# Altium schematic sheet Sheet3.SchDoc
size B; Author: E. Sims; Organization: Let's Build Rockets Inc.; SheetNumber: 4; SheetTotal: 4
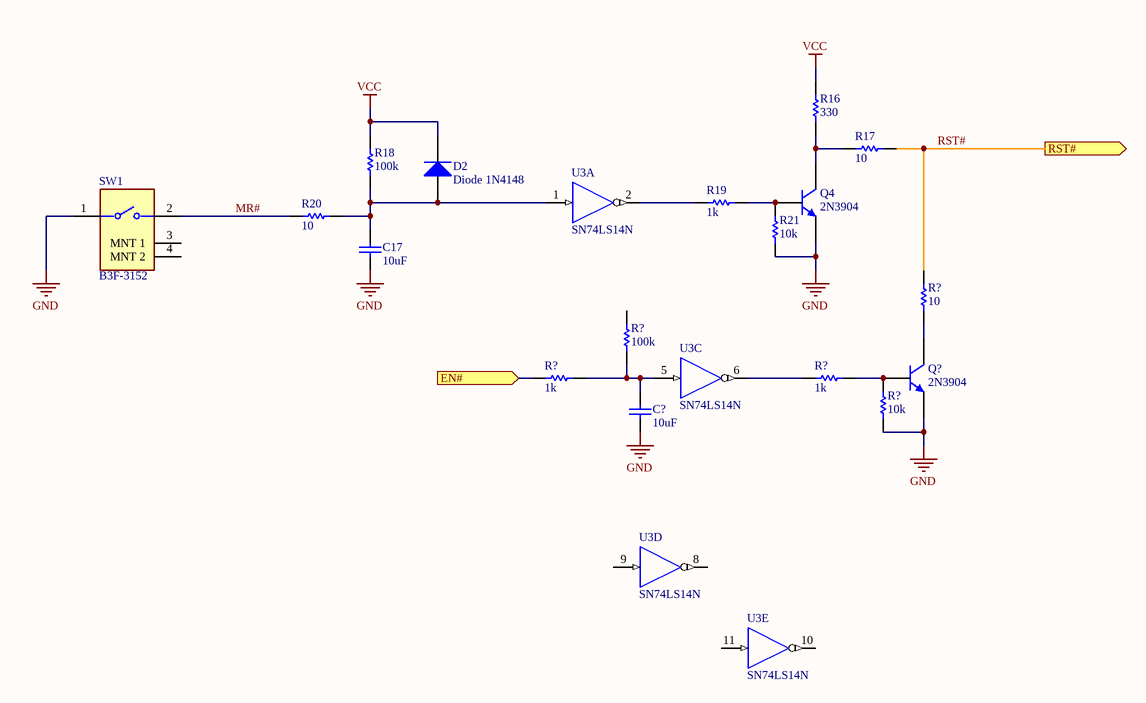
[diagram p0: Sheet3.SchDoc]

## Parts
(Parts that share a designator on the sheet are numbered #1, #2 ... from top to bottom, then left to right.)
C17  value 10uF  [RAD-0.3]  (hidden comment: Cap)
C?  value 10uF  [RAD-0.3]  (hidden comment: Cap)
D2  Diode 1N4148  [DO-35]
Q4  2N3904  [TO-92A]
Q?  2N3904  [TO-92A]
R16  value 330  [AXIAL-0.3]  (hidden comment: Res1)
R17  value 10  [AXIAL-0.3]  (hidden comment: Res1)
R18  value 100k  [AXIAL-0.3]  (hidden comment: Res1)
R19  value 1k  [AXIAL-0.3]  (hidden comment: Res1)
R20  value 10  [AXIAL-0.3]  (hidden comment: Res1)
R21  value 10k  [AXIAL-0.3]  (hidden comment: Res1)
R?#1  value 10  [AXIAL-0.3]  (hidden comment: Res1)
R?#2  value 100k  [AXIAL-0.3]  (hidden comment: Res1)
R?#3  value 1k  [AXIAL-0.3]  (hidden comment: Res1)
R?#4  value 1k  [AXIAL-0.3]  (hidden comment: Res1)
R?#5  value 10k  [AXIAL-0.3]  (hidden comment: Res1)
SW1  B3F-3152  [FP-B3F-3152-MFG]
U3  SN74LS14N  [N014]  (parts A,C,D,E of 6)

## Ports
EN# (in), RST# (out)

## Nets
GND: C17.1 C?.1 Q4.1(E) Q?.1(E) R21.2 R?#5.2 SW1.1 U3.7(GND)
VCC: D2.2(K) R16.1 R18.2 U3.14(VCC)
EN#: R?#3.2 ; port EN#
MR#: R20.2 SW1.2
RST#: R17.1 R?#1.1 ; port RST#
NetC17_2: C17.2 D2.1(A) R18.1 R20.1 U3.1(A)
NetC?_2: C?.2 R?#2.1 R?#3.1 U3.5(A)
NetQ4_2: Q4.2(B) R19.1 R21.1
NetQ4_3: Q4.3(C) R16.2 R17.2
NetQ?_2: Q?.2(B) R?#4.1 R?#5.1
NetQ?_3: Q?.3(C) R?#1.2
NetR19_2: R19.2 U3.2(Y)
NetR?#4_2: R?#4.2 U3.6(Y)

Not connected (* = marked no-connect by the designer): R?#2 2; SW1 3(MNT_1) 4(MNT_2); U3 8(Y) 9(A) 10(Y) 11(A)

## Notes on the sheet
- Let's Build Rocket's Inc. Modular Paylaod System Based on TMP-010 Rev
  For more information visit https://github.com/LetsBuildRockets/Modular-Payload-System
  This work is licensed under CC BY-NC 4.0. To view a copy of this license, visit https://creativecommons.org/licenses/by-nc/4.0
- Title
- Size:
- Date:
- Assembly Variant:
- B
- Number:
- Time:
- Revision:
- Sheet
- of
- Author:
- File:

## Library data of the parts
C17 C? = Cap: Capacitor; Published: 8-Jun-2000; LatestRevisionDate: 17-Jul-2002; LatestRevisionNote: Re-released for DXP Platform.; PackageReference: RAD-0.3; Publisher: Altium Limited; PackageDescription: Radial Cap, Thru-Hole; 2 Leads; 0.3 in Pin Spacing
D2 = Diode 1N4148: High Conductance Fast Diode; Published: 8-Jun-2000; LatestRevisionDate: 17-Jul-2002; LatestRevisionNote: Re-released for DXP Platform.; DatasheetVersion: 1997; PackageReference: DO-35; Publisher: Altium Limited; PackageDescription: Diode, Axial; Body 3.8 x 1.9 mm (LxDia. max), Lead Dia. 0.53 mm (max); Code_JEDEC: DO-204-AH; ComponentLink1Description: Manufacturer Link; ComponentLink1URL: http://www.fairchildsemi.com/; ComponentLink2Description: Datasheet; ComponentLink2URL: http://www.fairchildsemi.com/ds/1N%2F1N4148.pdf
Q4 Q? = 2N3904: NPN General Purpose Amplifier; Published: 8-Jun-2000; LatestRevisionDate: 15-Jan-2003; LatestRevisionNote: PCB Footprint 'BCY-W3/D4.7' replaced; DatasheetVersion: 1997; PackageVersion: Sep-1998; PackageReference: TO-92A; Publisher: Altium Limited; PackageDescription: TO, Flat Index; 3 In-Line, Axial Leads; Body Dia. 4.5mm; Leads 0.51 x 0.48 mm (max); ComponentLink1Description: Manufacturer Link; ComponentLink1URL: http://www.fairchildsemi.com/; ComponentLink2Description: Datasheet; ComponentLink2URL: http://www.fairchildsemi.com/ds/2N%2F2N3904.pdf
R16-R21 R?#1-R?#5 = Res1: Resistor; Published: 8-Jun-2000; LatestRevisionDate: 17-Jul-2002; LatestRevisionNote: Re-released for DXP Platform.; PackageReference: AXIAL-0.3; Publisher: Altium Limited; PackageDescription: Axial Device, Thru-Hole; 2 Leads; 0.3 in Pin Spacing
SW1 = CMP-08834-000033-1: SWITCH TACTILE SPST-NO 0.05A 24V; Mechanical Life: 300000Cycles; Max Current Rating: 50mA; Illumination Type: Non-Illuminated; Actuator Color: Yellow; Throw Configuration: SPST; Switch Function: Off-Mom; Ratings: IP00; Switch Travel: 0.25mm; Actuator Type: PLUNGER; Contact Resistance: 100mR; Number of Poles: 1; Operating Force: 1.47N; Height: 6.15mm; Contact Plating: Gold; Contact Type: 1 maker; Termination: PC Pins; Radiation Hardening: No; Contact Material: Gold; Number of Pins: 4; Length: 7.3mm; Width: 6mm; Weight: 0.25g; Packaging: Bulk; Contact Current Rating: 50mA; Max Operating Temperature: 70°C; Lead Free: Lead Free; Mount: Through Hole; RoHS Compliant: Yes; Series: B3F; Orientation: Right Angle; Package Quantity: 1000; Current Rating: 50mA; Max Voltage Rating (DC): 24V; Min Operating Temperature: -25°C; Electrical Life: 300000Cycles; Depth: 7.15mm; Voltage Rating (DC): 24V
U3 = SN74LS14N: Hex Schmitt-Trigger Inverter; Published: 8-Jun-2000; LatestRevisionDate: 04-Mar-2005; LatestRevisionNote: Stylized 3D Model Added.; DatasheetVersion: Mar-1988; PackageVersion: Oct-1995; PackageReference: N014; Publisher: Altium Limited; PackageDescription: DIP; 14 Leads; Row Spacing 7.62 mm; Pitch 2.54 mm; ComponentLink1Description: Manufacturer Link; ComponentLink1URL: http://www.ti.com/; ComponentLink2Description: Datasheet; ComponentLink2URL: http://www-s.ti.com/sc/ds/sn74ls14.pdf